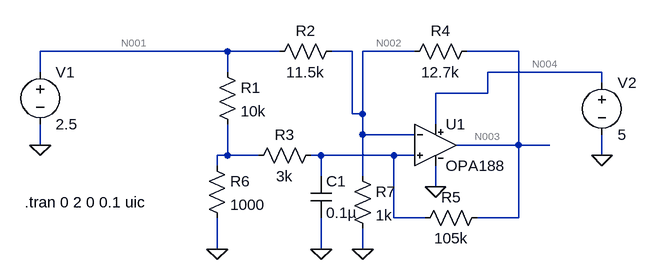
[diagram p0: schematic PT1000.asc]
PT1000.asc, the LTspice schematic file:
Version 4
SHEET 1 880 680
WIRE 64 32 -224 32
WIRE 144 32 64 32
WIRE 256 32 224 32
WIRE 352 32 272 32
WIRE 512 32 432 32
WIRE -224 64 -224 32
WIRE 64 64 64 32
WIRE 640 64 464 64
WIRE 640 80 640 64
WIRE 464 96 464 64
WIRE 464 96 384 96
WIRE 256 128 256 32
WIRE 272 128 272 32
WIRE 272 128 256 128
WIRE 384 144 384 96
WIRE 272 160 272 128
WIRE 352 160 272 160
WIRE -224 176 -224 144
WIRE 512 176 512 32
WIRE 512 176 416 176
WIRE 560 176 512 176
WIRE 64 192 64 144
WIRE 64 192 48 192
WIRE 112 192 64 192
WIRE 208 192 192 192
WIRE 320 192 208 192
WIRE 352 192 320 192
WIRE 640 192 640 160
WIRE 48 208 48 192
WIRE 208 224 208 192
WIRE 272 224 272 160
WIRE 384 240 384 208
WIRE 320 288 320 192
WIRE 368 288 320 288
WIRE 512 288 512 176
WIRE 512 288 448 288
WIRE 48 336 48 288
WIRE 208 336 208 288
WIRE 272 336 272 304
FLAG -224 176 0
FLAG 48 336 0
FLAG 384 240 0
FLAG 640 192 0
FLAG 272 336 0
FLAG 208 336 0
SYMBOL voltage -224 48 R0
WINDOW 123 0 0 Left 2
WINDOW 39 0 0 Left 2
SYMATTR InstName V1
SYMATTR Value 2.5
SYMBOL Opamps\\OPA188 384 112 R0
SYMATTR InstName U1
SYMBOL res 48 48 R0
SYMATTR InstName R1
SYMATTR Value 10k
SYMBOL res 240 16 R90
WINDOW 0 0 56 VBottom 2
WINDOW 3 32 56 VTop 2
SYMATTR InstName R2
SYMATTR Value 11.5k
SYMBOL res 208 176 R90
WINDOW 0 0 56 VBottom 2
WINDOW 3 32 56 VTop 2
SYMATTR InstName R3
SYMATTR Value 3k
SYMBOL res 448 16 R90
WINDOW 0 0 56 VBottom 2
WINDOW 3 32 56 VTop 2
SYMATTR InstName R4
SYMATTR Value 12.7k
SYMBOL res 464 272 R90
WINDOW 0 0 56 VBottom 2
WINDOW 3 32 56 VTop 2
SYMATTR InstName R5
SYMATTR Value 105k
SYMBOL voltage 640 64 R0
WINDOW 123 0 0 Left 2
WINDOW 39 0 0 Left 2
SYMATTR InstName V2
SYMATTR Value 5
SYMBOL res 32 192 R0
SYMATTR InstName R6
SYMATTR Value 1000
SYMBOL res 256 208 R0
SYMATTR InstName R7
SYMATTR Value 1k
SYMBOL cap 192 224 R0
SYMATTR InstName C1
SYMATTR Value 0.1µ
SYMATTR SpiceLine V=50 Irms=1.34 Rser=0.0989014 Lser=0 mfg="KEMET" pn="C0805C104K5RAC" type="X7R"
TEXT -248 264 Left 2 !.tran 0 2 0 0.1 uic

The netlist it stands for:
* PT1000.asc
V1 N001 0 2.5
XU1 N006 N002 N004 0 N003 OPA188  ; pins In+ In- V+ V- OUT
R1 N001 N005 10k
R2 N002 N001 11.5k
R3 N006 N005 3k
R4 N003 N002 12.7k
R5 N003 N006 105k
V2 N004 0 5
R6 N005 0 1000
R7 N002 0 1k
C1 N006 0 0.1µ V=50 Irms=1.34 Rser=0.0989014 Lser=0 mfg="KEMET" pn="C0805C104K5RAC" type="X7R"
.tran 0 2 0 0.1 uic
.lib OPA188.sub
.backanno
.end

* Results of the author's LTspice run, read from the files saved beside the schematic
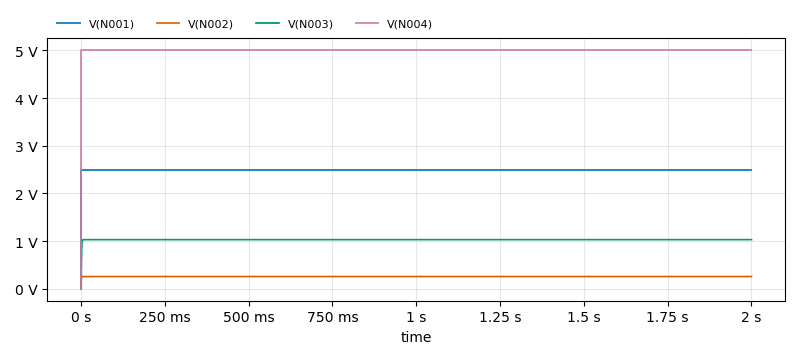
[diagram p1: Transient Analysis of PT1000.asc, plotted from the saved traces]
* Transient Analysis, 1 run:
*   V(N001): min 0 V, max 2.5 V, average 2.5 V, rms 2.5 V, last 2.5 V
*   V(N002): min 0 V, max 256.1 mV, average 256 mV, rms 256.1 mV, last 256.1 mV
*   V(N003): min -496.3 µV, max 1.031 V, average 1.03 V, rms 1.03 V, last 1.031 V
*   V(N004): min 0 V, max 5 V, average 5 V, rms 5 V, last 5 V